# EAGLE board unified (EAGLE 7.7.0)
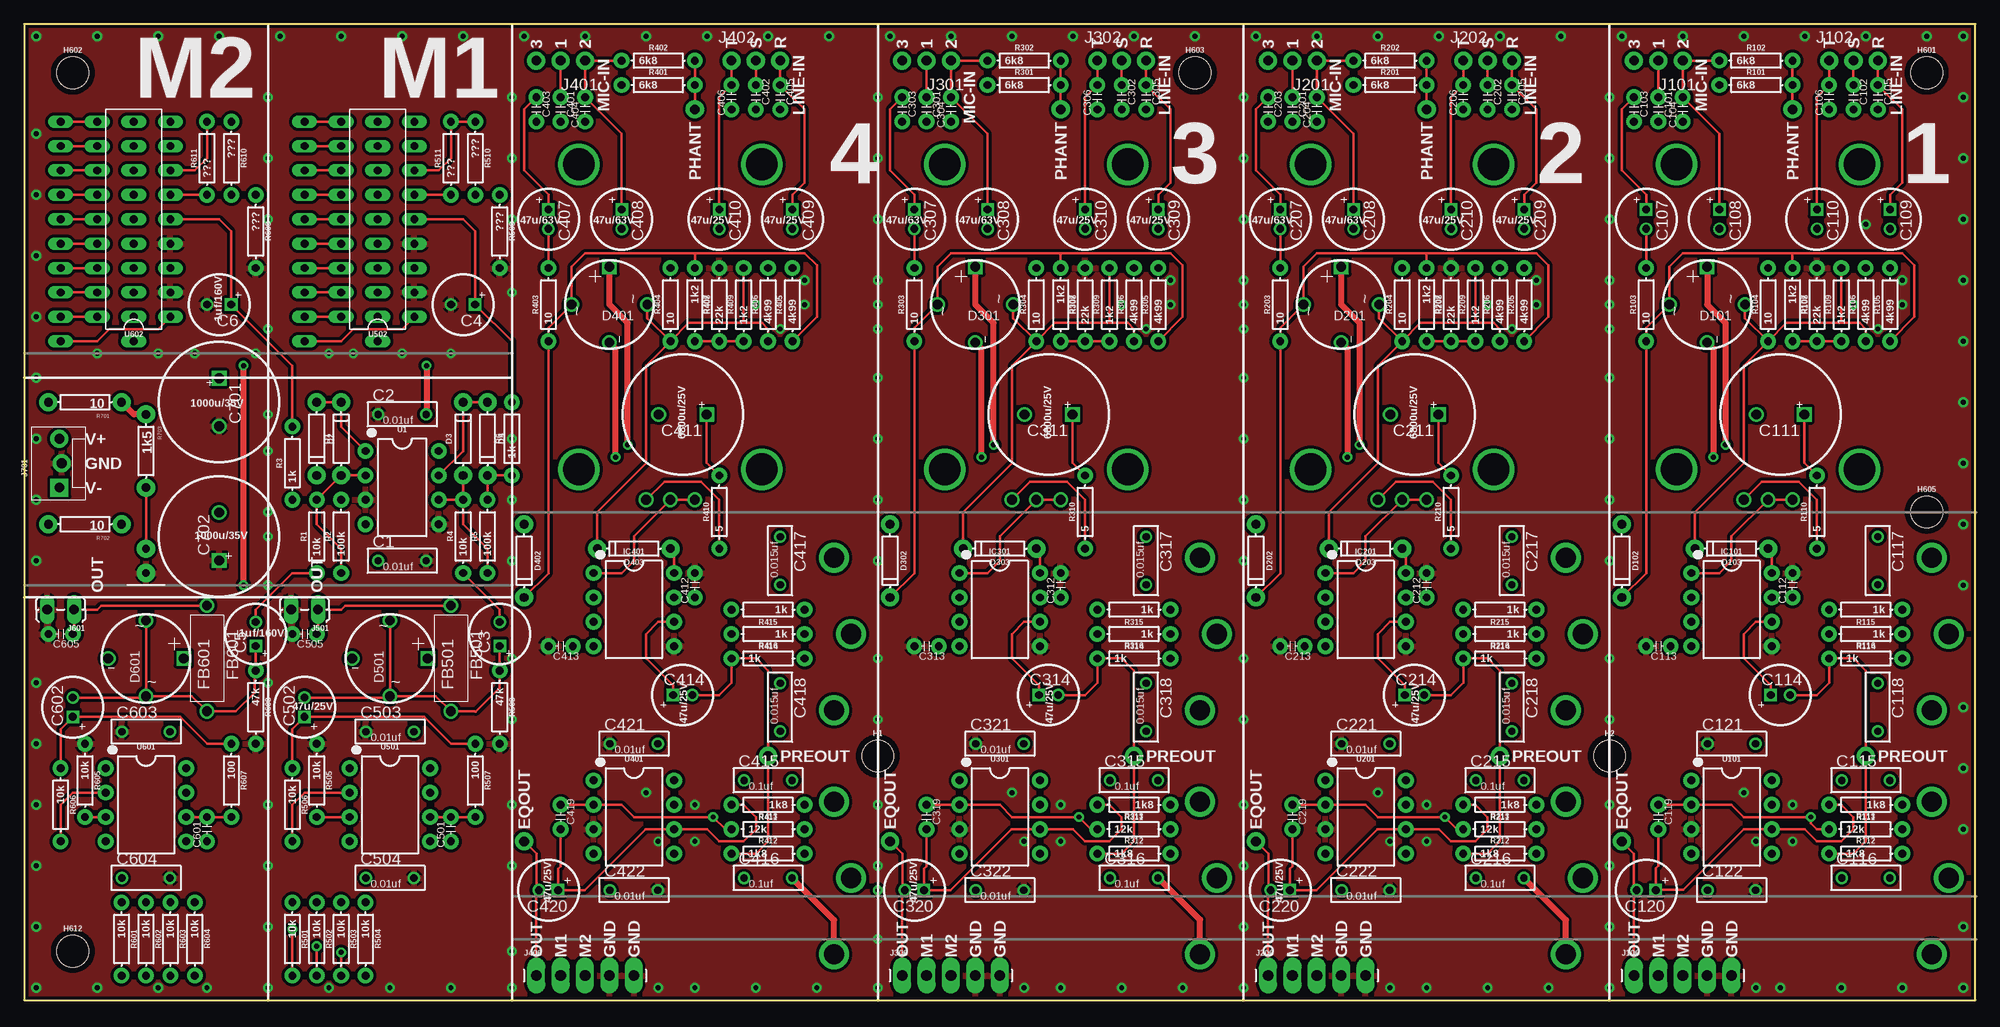
[diagram p7: board, top side]
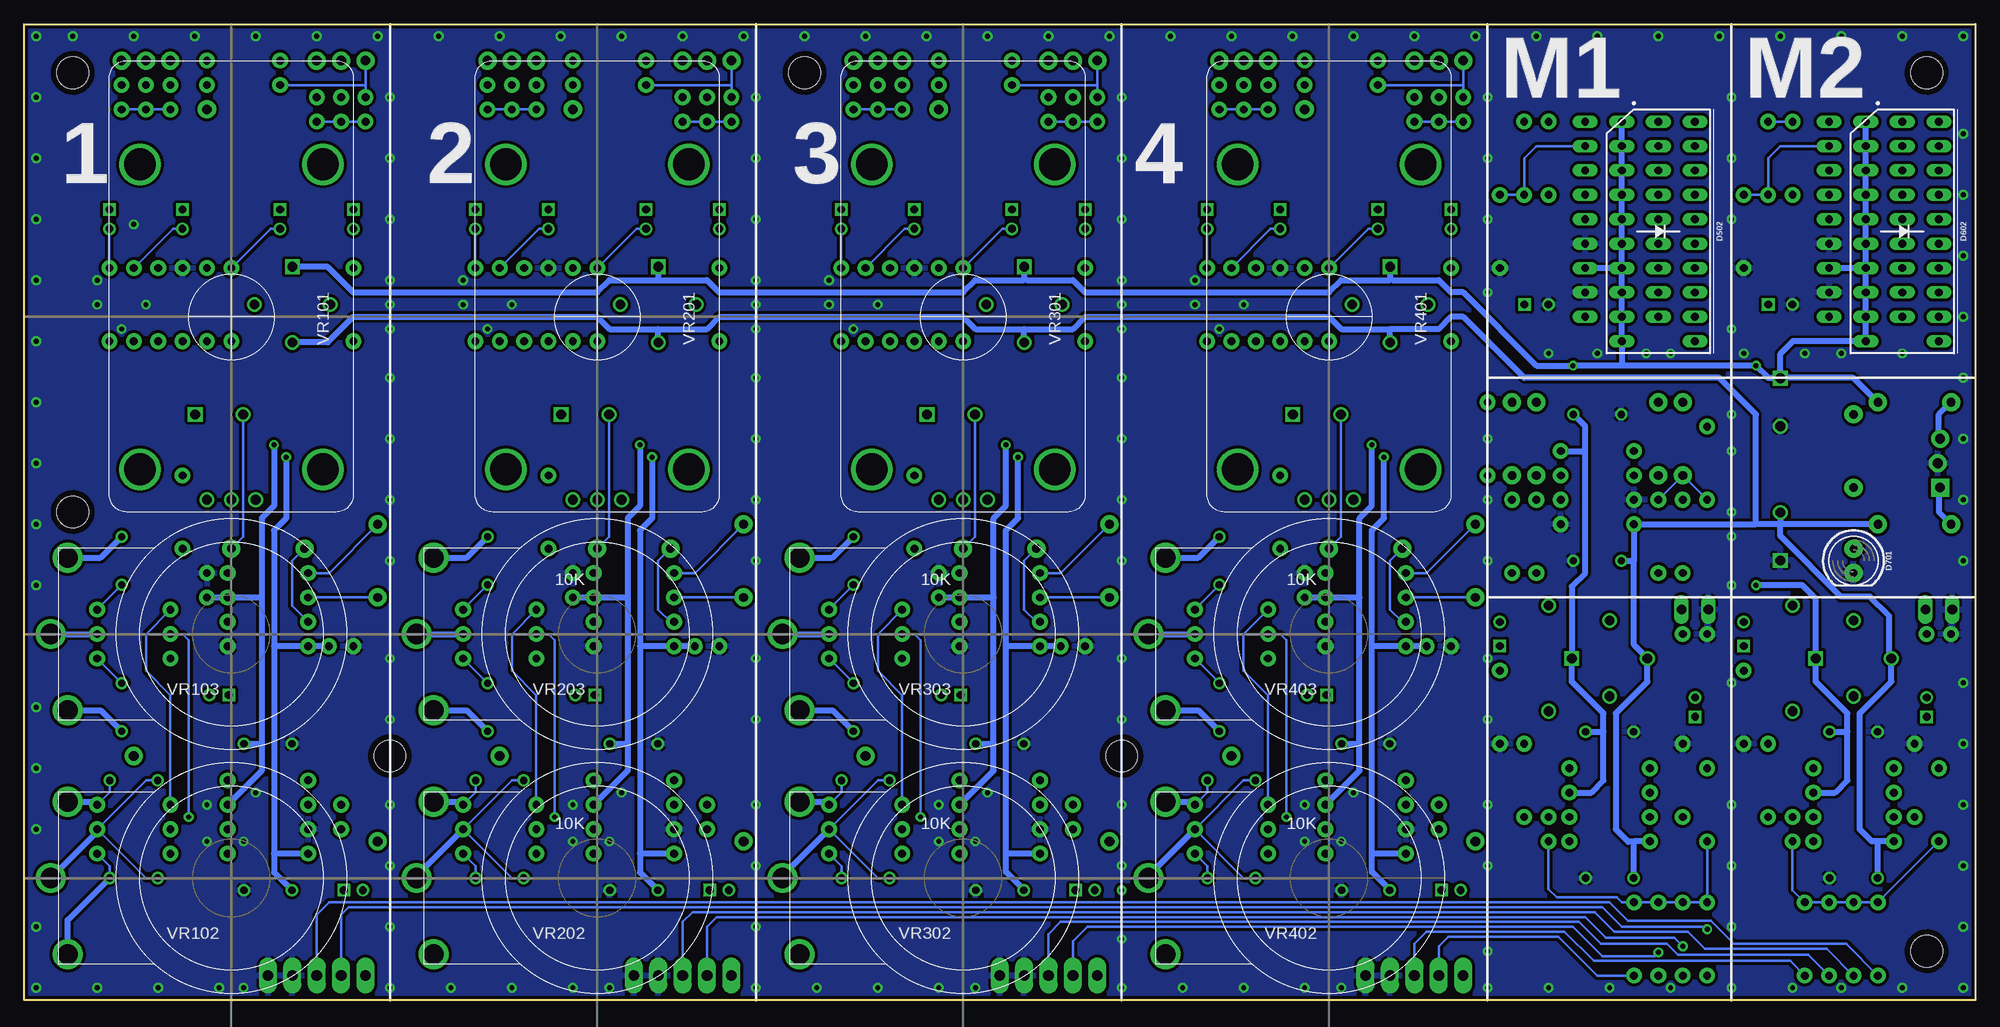
[diagram p8: board, bottom side, seen from below]

Size 203.2 x 101.6 mm. Coordinates in mm from the lower left corner, seen from the top.
Outline: 0,0 203.2,0 203.2,101.6 0,101.6 0,0
Copper layers (1*16): Top 0.035mm / dielectric 1.5mm / Bottom 0.035mm
Design rules "SparkFun-2-layer-STANDARD *": minimum track width 10mil, minimum drill 20mil, track to track 10mil, track to pad 10mil, pad to pad 10mil, via to via 10mil, smd to smd 8mil, copper to edge 8mil, drill to drill 8mil, minimum pad ring 10mil, minimum via ring 10mil, stop-mask expansion 4mil, vias tented up to drill 20mil, thermal gap 10mil
Net classes: 1 power: width 0.61 mm, drill 0.381 mm, clearance 0.254 mm; 2 signal: width 0.254 mm, drill 0.381 mm, clearance 0.254 mm

## Footprints (pad centres in the part's own frame; a part is rotated, then mirrored left to right if it is on the bottom)
WIMA-MKS2-2.5X7.2 = drill 0.75: P$1 2.5,0; P$2 -2.5,0
CAP-PANA-2.5LS-6DIAM = drill 0.8: NEG 1.25,0 | drill 0.8 square: POS -1.25,0
CAP-KEMET-GM-2.54LS = drill 0.813 pad 1.626: P$1 -1.27,0; P$2 1.27,0
CAP-PANA-2LS-6DIAM = drill 0.8: NEG 1,0 | drill 0.8 square: POS -1,0
CAP-PANA-2LS-5DIAM = drill 0.8: NEG 1,0 | drill 0.8 square: POS -1,0
CAP-PANA-5LS-12.5DIAM = drill 1.016: NEG 2.5,0 | drill 1.016 square: POS -2.5,0
DIODE-1N4148 = drill 0.9 pad 1.88: A -3.81,0; C 3.81,0
SM-RECTIFIER = drill 1.016: AC1 -3.937,0; AC2 3.937,0; NEG 0,3.937 | drill 1.016 square: POS 0,-3.937
LED_BARGRAPH_10 = drill 0.813 long: 1 -11.43,-3.81; 2 -8.89,-3.81; 3 -6.35,-3.81; 4 -3.81,-3.81; 5 -1.27,-3.81; 6 1.27,-3.81; 7 3.81,-3.81; 8 6.35,-3.81; 9 8.89,-3.81; 10 11.43,-3.81; 11 11.43,3.81; 12 8.89,3.81; 13 6.35,3.81; 14 3.81,3.81; 15 1.27,3.81; 16 -1.27,3.81; 17 -3.81,3.81; 18 -6.35,3.81; 19 -8.89,3.81; 20 -11.43,3.81
LED_5MM = drill 0.813 pad 1.88: A -1.27,0; K 1.27,0
BEAD = drill 1.016: P$1 5.5,0; P$2 -5.5,0
STAND-OFF = hole 3.302: 0,0
DIP08-KIT = drill 0.813 pad 1.626: 1 -3.81,-4.191; 2 -1.27,-4.191; 3 1.27,-4.191; 4 3.81,-4.191; 5 3.81,4.191; 6 1.27,4.191; 7 -1.27,4.191; 8 -3.81,4.191
1X03_NO_SILK@1 = drill 1.016 pad 1.88: 1 0,0; 2 2.54,0; 3 5.08,0
1X01NS-KIT = drill 1.016 pad 1.88: 1 0,0
1X05_LONGPADS = drill 1.118 pad 1.88 long: 1 0,0; 2 2.54,0; 3 5.08,0; 4 7.62,0; 5 10.16,0
1X02_LOCK_LONGPADS = drill 1.016 long: 1 -0.127,0; 2 2.667,0
MOLEX-1X3_LOCK = drill 1.016 pad 1.88 square: 1 0,0.127 | drill 1.016 pad 1.88: 2 2.54,-0.127; 3 5.08,0.127
AXIAL-0.3 = drill 0.813 pad 1.626: P$1 -3.81,0; P$2 3.81,0
AXIAL-0.3' = drill 0.9 pad 1.88: P$1 -3.81,0; P$2 3.81,0
DIP08 = drill 0.813 pad 1.626: 1 -3.81,-3.81; 2 -1.27,-3.81; 3 1.27,-3.81; 4 3.81,-3.81; 5 3.81,3.81; 6 1.27,3.81; 7 -1.27,3.81; 8 -3.81,3.81
DIL18 = drill 0.813 long: 1 -10.16,-3.81; 2 -7.62,-3.81; 3 -5.08,-3.81; 4 -2.54,-3.81; 5 0,-3.81; 6 2.54,-3.81; 7 5.08,-3.81; 8 7.62,-3.81; 9 10.16,-3.81; 10 10.16,3.81; 11 7.62,3.81; 12 5.08,3.81; 13 2.54,3.81; 14 0,3.81; 15 -2.54,3.81; 16 -5.08,3.81; 17 -7.62,3.81; 18 -10.16,3.81
ROT-SW-POT = drill 1.016: CCW 19.05,-2.54; CW 19.05,2.54; WIP 19.05,0 | drill 3.302: P$1 -15.875,-9.525; P$2 -15.875,9.525; P$3 15.875,9.525; P$4 15.875,-9.525
ALPHA-RV24AF40-POT = drill 2.1: CCW 17.039,-7.945; CW 17.039,7.945; WIP 18.8,0

## Placement (x,y rotation side)
C1  0.01uf  [WIMA-MKS2-2.5X7.2]  39.37,45.72 0 top
C2  0.01uf  [WIMA-MKS2-2.5X7.2]  39.37,60.96 0 top
C3  1uf/160V  [CAP-PANA-2.5LS-6DIAM]  49.53,38.1 90 top
C4  1uf/160V  [CAP-PANA-2.5LS-6DIAM]  45.72,72.39 180 top
C5  1uf/160V  [CAP-PANA-2.5LS-6DIAM]  24.13,38.1 90 top
C6  1uf/160V  [CAP-PANA-2.5LS-6DIAM]  20.32,72.39 180 top
C101  47pf  [CAP-KEMET-GM-2.54LS]  170.18,92.71 270 top
C102  47pf  [CAP-KEMET-GM-2.54LS]  190.5,93.98 270 top
C103  470pf  [CAP-KEMET-GM-2.54LS]  167.64,92.71 270 top
C104  470pf  [CAP-KEMET-GM-2.54LS]  172.72,92.71 90 top
C105  470pf  [CAP-KEMET-GM-2.54LS]  193.04,93.98 270 top
C106  470pf  [CAP-KEMET-GM-2.54LS]  187.96,93.98 90 top
C107  47u/63V  [CAP-PANA-2LS-6DIAM]  168.91,81.28 270 top
C108  47u/63V  [CAP-PANA-2LS-6DIAM]  176.53,81.28 270 top
C109  47u/25V  [CAP-PANA-2LS-5DIAM]  194.31,81.28 270 top
C110  47u/25V  [CAP-PANA-2LS-5DIAM]  186.69,81.28 270 top
C111  6800u/25V  [CAP-PANA-5LS-12.5DIAM]  182.88,60.96 180 top
C112  470pf  [CAP-KEMET-GM-2.54LS]  184.15,43.18 90 top
C113  470pf  [CAP-KEMET-GM-2.54LS]  170.18,36.83 180 top
C114  47u/25V  [CAP-PANA-2LS-5DIAM]  182.88,31.75 0 top
C115  0.1uf  [WIMA-MKS2-2.5X7.2]  191.77,22.86 0 top
C116  0.1uf  [WIMA-MKS2-2.5X7.2]  191.77,12.7 0 top
C117  0.015uf  [WIMA-MKS2-2.5X7.2]  193.04,45.72 270 top
C118  0.015uf  [WIMA-MKS2-2.5X7.2]  193.04,30.48 270 top
C119  100pf  [CAP-KEMET-GM-2.54LS]  170.18,19.05 270 top
C120  47u/25V  [CAP-PANA-2LS-5DIAM]  168.91,11.43 180 top
C121  0.01uf  [WIMA-MKS2-2.5X7.2]  177.8,26.67 0 top
C122  0.01uf  [WIMA-MKS2-2.5X7.2]  177.8,11.43 0 top
C201  47pf  [CAP-KEMET-GM-2.54LS]  132.08,92.71 270 top
C202  47pf  [CAP-KEMET-GM-2.54LS]  152.4,93.98 270 top
C203  470pf  [CAP-KEMET-GM-2.54LS]  129.54,92.71 270 top
C204  470pf  [CAP-KEMET-GM-2.54LS]  134.62,92.71 90 top
C205  470pf  [CAP-KEMET-GM-2.54LS]  154.94,93.98 270 top
C206  470pf  [CAP-KEMET-GM-2.54LS]  149.86,93.98 90 top
C207  47u/63V  [CAP-PANA-2LS-6DIAM]  130.81,81.28 270 top
C208  47u/63V  [CAP-PANA-2LS-6DIAM]  138.43,81.28 270 top
C209  47u/25V  [CAP-PANA-2LS-5DIAM]  156.21,81.28 270 top
C210  47u/25V  [CAP-PANA-2LS-5DIAM]  148.59,81.28 270 top
C211  6800u/25V  [CAP-PANA-5LS-12.5DIAM]  144.78,60.96 180 top
C212  470pf  [CAP-KEMET-GM-2.54LS]  146.05,43.18 90 top
C213  470pf  [CAP-KEMET-GM-2.54LS]  132.08,36.83 180 top
C214  47u/25V  [CAP-PANA-2LS-5DIAM]  144.78,31.75 0 top
C215  0.1uf  [WIMA-MKS2-2.5X7.2]  153.67,22.86 0 top
C216  0.1uf  [WIMA-MKS2-2.5X7.2]  153.67,12.7 0 top
C217  0.015uf  [WIMA-MKS2-2.5X7.2]  154.94,45.72 270 top
C218  0.015uf  [WIMA-MKS2-2.5X7.2]  154.94,30.48 270 top
C219  100pf  [CAP-KEMET-GM-2.54LS]  132.08,19.05 270 top
C220  47u/25V  [CAP-PANA-2LS-5DIAM]  130.81,11.43 180 top
C221  0.01uf  [WIMA-MKS2-2.5X7.2]  139.7,26.67 0 top
C222  0.01uf  [WIMA-MKS2-2.5X7.2]  139.7,11.43 0 top
C301  47pf  [CAP-KEMET-GM-2.54LS]  93.98,92.71 270 top
C302  47pf  [CAP-KEMET-GM-2.54LS]  114.3,93.98 270 top
C303  470pf  [CAP-KEMET-GM-2.54LS]  91.44,92.71 270 top
C304  470pf  [CAP-KEMET-GM-2.54LS]  96.52,92.71 90 top
C305  470pf  [CAP-KEMET-GM-2.54LS]  116.84,93.98 270 top
C306  470pf  [CAP-KEMET-GM-2.54LS]  111.76,93.98 90 top
C307  47u/63V  [CAP-PANA-2LS-6DIAM]  92.71,81.28 270 top
C308  47u/63V  [CAP-PANA-2LS-6DIAM]  100.33,81.28 270 top
C309  47u/25V  [CAP-PANA-2LS-5DIAM]  118.11,81.28 270 top
C310  47u/25V  [CAP-PANA-2LS-5DIAM]  110.49,81.28 270 top
C311  6800u/25V  [CAP-PANA-5LS-12.5DIAM]  106.68,60.96 180 top
C312  470pf  [CAP-KEMET-GM-2.54LS]  107.95,43.18 90 top
C313  470pf  [CAP-KEMET-GM-2.54LS]  93.98,36.83 180 top
C314  47u/25V  [CAP-PANA-2LS-5DIAM]  106.68,31.75 0 top
C315  0.1uf  [WIMA-MKS2-2.5X7.2]  115.57,22.86 0 top
C316  0.1uf  [WIMA-MKS2-2.5X7.2]  115.57,12.7 0 top
C317  0.015uf  [WIMA-MKS2-2.5X7.2]  116.84,45.72 270 top
C318  0.015uf  [WIMA-MKS2-2.5X7.2]  116.84,30.48 270 top
C319  100pf  [CAP-KEMET-GM-2.54LS]  93.98,19.05 270 top
C320  47u/25V  [CAP-PANA-2LS-5DIAM]  92.71,11.43 180 top
C321  0.01uf  [WIMA-MKS2-2.5X7.2]  101.6,26.67 0 top
C322  0.01uf  [WIMA-MKS2-2.5X7.2]  101.6,11.43 0 top
C401  47pf  [CAP-KEMET-GM-2.54LS]  55.88,92.71 270 top
C402  47pf  [CAP-KEMET-GM-2.54LS]  76.2,93.98 270 top
C403  470pf  [CAP-KEMET-GM-2.54LS]  53.34,92.71 270 top
C404  470pf  [CAP-KEMET-GM-2.54LS]  58.42,92.71 90 top
C405  470pf  [CAP-KEMET-GM-2.54LS]  78.74,93.98 270 top
C406  470pf  [CAP-KEMET-GM-2.54LS]  73.66,93.98 90 top
C407  47u/63V  [CAP-PANA-2LS-6DIAM]  54.61,81.28 270 top
C408  47u/63V  [CAP-PANA-2LS-6DIAM]  62.23,81.28 270 top
C409  47u/25V  [CAP-PANA-2LS-5DIAM]  80.01,81.28 270 top
C410  47u/25V  [CAP-PANA-2LS-5DIAM]  72.39,81.28 270 top
C411  6800u/25V  [CAP-PANA-5LS-12.5DIAM]  68.58,60.96 180 top
C412  470pf  [CAP-KEMET-GM-2.54LS]  69.85,43.18 90 top
C413  470pf  [CAP-KEMET-GM-2.54LS]  55.88,36.83 180 top
C414  47u/25V  [CAP-PANA-2LS-5DIAM]  68.58,31.75 0 top
C415  0.1uf  [WIMA-MKS2-2.5X7.2]  77.47,22.86 0 top
C416  0.1uf  [WIMA-MKS2-2.5X7.2]  77.47,12.7 0 top
C417  0.015uf  [WIMA-MKS2-2.5X7.2]  78.74,45.72 270 top
C418  0.015uf  [WIMA-MKS2-2.5X7.2]  78.74,30.48 270 top
C419  100pf  [CAP-KEMET-GM-2.54LS]  55.88,19.05 270 top
C420  47u/25V  [CAP-PANA-2LS-5DIAM]  54.61,11.43 180 top
C421  0.01uf  [WIMA-MKS2-2.5X7.2]  63.5,26.67 0 top
C422  0.01uf  [WIMA-MKS2-2.5X7.2]  63.5,11.43 0 top
C501  100pf  [CAP-KEMET-GM-2.54LS]  44.45,17.78 90 top
C502  47u/25V  [CAP-PANA-2LS-5DIAM]  29.21,30.48 90 top
C503  0.01uf  [WIMA-MKS2-2.5X7.2]  38.1,27.94 0 top
C504  0.01uf  [WIMA-MKS2-2.5X7.2]  38.1,12.7 0 top
C505  100pf  [CAP-KEMET-GM-2.54LS]  29.21,38.1 180 top
C601  100pf  [CAP-KEMET-GM-2.54LS]  19.05,17.78 90 top
C602  47u/25V  [CAP-PANA-2LS-5DIAM]  5.08,30.48 90 top
C603  0.01uf  [WIMA-MKS2-2.5X7.2]  12.7,27.94 0 top
C604  0.01uf  [WIMA-MKS2-2.5X7.2]  12.7,12.7 0 top
C605  100pf  [CAP-KEMET-GM-2.54LS]  3.81,38.1 180 top
C701  1000u/35V  [CAP-PANA-5LS-12.5DIAM]  20.32,62.23 270 top
C702  1000u/35V  [CAP-PANA-5LS-12.5DIAM]  20.32,48.26 90 top
D1  1n4148  [DIODE-1N4148]  33.02,58.42 90 top
D2  1n4148  [DIODE-1N4148]  30.48,58.42 270 top
D3  1n4148  [DIODE-1N4148]  45.72,58.42 90 top
D4  1n4148  [DIODE-1N4148]  48.26,58.42 270 top
D101  RECTIFIERRB15X  [SM-RECTIFIER]  175.26,72.39 180 top
D102  200mA/100V/1V  [DIODE-1N4148]  166.37,45.72 270 top
D103  200mA/100V/1V  [DIODE-1N4148]  177.8,46.99 180 top
D201  RECTIFIERRB15X  [SM-RECTIFIER]  137.16,72.39 180 top
D202  200mA/100V/1V  [DIODE-1N4148]  128.27,45.72 270 top
D203  200mA/100V/1V  [DIODE-1N4148]  139.7,46.99 180 top
D301  RECTIFIERRB15X  [SM-RECTIFIER]  99.06,72.39 180 top
D302  200mA/100V/1V  [DIODE-1N4148]  90.17,45.72 270 top
D303  200mA/100V/1V  [DIODE-1N4148]  101.6,46.99 180 top
D401  RECTIFIERRB15X  [SM-RECTIFIER]  60.96,72.39 180 top
D402  200mA/100V/1V  [DIODE-1N4148]  52.07,45.72 270 top
D403  200mA/100V/1V  [DIODE-1N4148]  63.5,46.99 180 top
D501  RECTIFIERRB15X  [SM-RECTIFIER]  38.1,35.56 90 top
D502  RED  [LED_BARGRAPH_10]  33.02,80.01 270 bottom
D601  RECTIFIERRB15X  [SM-RECTIFIER]  12.7,35.56 90 top
D602  RED  [LED_BARGRAPH_10]  7.62,80.01 270 bottom
D701  [LED_5MM]  12.7,45.72 270 bottom
FB501  FB  [BEAD]  44.45,35.56 270 top
FB601  FB  [BEAD]  19.05,35.56 270 top
FRAME101  FRAME-LEDGER  [CREATIVE_COMMONS]  81.28,-71.12 0 top  (outside the outline)
FRAME201  FRAME-LEDGER  [CREATIVE_COMMONS]  81.28,-71.12 0 top  (outside the outline)
FRAME301  FRAME-LEDGER  [CREATIVE_COMMONS]  81.28,-71.12 0 top  (outside the outline)
FRAME401  FRAME-LEDGER  [CREATIVE_COMMONS]  81.28,-71.12 0 top  (outside the outline)
FRAME501  FRAME-LEDGER  [CREATIVE_COMMONS]  81.28,-71.12 0 top  (outside the outline)
FRAME601  FRAME-LEDGER  [CREATIVE_COMMONS]  81.28,-71.12 0 top  (outside the outline)
FRAME701  FRAME-LEDGER  [CREATIVE_COMMONS]  81.28,-71.12 0 top  (outside the outline)
H1  STAND-OFF  [STAND-OFF]  88.9,25.4 0 top
H2  STAND-OFF  [STAND-OFF]  165.1,25.4 0 top
H601  STAND-OFF  [STAND-OFF]  198.12,96.52 0 top
H602  STAND-OFF  [STAND-OFF]  5.08,96.52 0 top
H603  STAND-OFF  [STAND-OFF]  121.92,96.52 0 top
H605  STAND-OFF  [STAND-OFF]  198.12,50.8 0 top
H612  STAND-OFF  [STAND-OFF]  5.08,5.08 0 top
IC101  THAT1512  [DIP08-KIT]  177.8,40.64 270 top
IC201  THAT1512  [DIP08-KIT]  139.7,40.64 270 top
IC301  THAT1512  [DIP08-KIT]  101.6,40.64 270 top
IC401  THAT1512  [DIP08-KIT]  63.5,40.64 270 top
J101  [1X03_NO_SILK@1]  172.72,97.79 180 top
J102  [1X03_NO_SILK@1]  187.96,97.79 0 top
J103  phantom  [1X01NS-KIT]  184.15,92.71 90 top
J104  eqout  [1X01NS-KIT]  191.77,25.4 90 top
J105  eqout  [1X01NS-KIT]  166.37,16.51 0 top
J106  [1X05_LONGPADS]  167.64,2.54 0 top
J201  [1X03_NO_SILK@1]  134.62,97.79 180 top
J202  [1X03_NO_SILK@1]  149.86,97.79 0 top
J203  phantom  [1X01NS-KIT]  146.05,92.71 0 top
J204  eqout  [1X01NS-KIT]  153.67,25.4 0 top
J205  eqout  [1X01NS-KIT]  128.27,16.51 0 top
J206  [1X05_LONGPADS]  129.54,2.54 0 top
J301  [1X03_NO_SILK@1]  96.52,97.79 180 top
J302  [1X03_NO_SILK@1]  111.76,97.79 0 top
J303  phantom  [1X01NS-KIT]  107.95,92.71 0 top
J304  eqout  [1X01NS-KIT]  115.57,25.4 0 top
J305  eqout  [1X01NS-KIT]  90.17,16.51 0 top
J306  [1X05_LONGPADS]  91.44,2.54 0 top
J401  [1X03_NO_SILK@1]  58.42,97.79 180 top
J402  [1X03_NO_SILK@1]  73.66,97.79 0 top
J403  phantom  [1X01NS-KIT]  69.85,92.71 0 top
J404  eqout  [1X01NS-KIT]  77.47,25.4 0 top
J405  eqout  [1X01NS-KIT]  52.07,16.51 0 top
J406  [1X05_LONGPADS]  53.34,2.54 0 top
J501  out2  [1X02_LOCK_LONGPADS]  30.48,40.64 180 top
J601  out2  [1X02_LOCK_LONGPADS]  5.08,40.64 180 top
J701  power  [MOLEX-1X3_LOCK]  3.81,53.34 90 top
R1  10k  [AXIAL-0.3]  30.48,48.26 90 top
R2  100k  [AXIAL-0.3]  33.02,48.26 90 top
R3  1k  [AXIAL-0.3]  27.94,55.88 90 top
R4  10k  [AXIAL-0.3]  45.72,48.26 90 top
R5  100k  [AXIAL-0.3]  48.26,48.26 90 top
R6  1k  [AXIAL-0.3]  50.8,58.42 90 top
R101  6k8  [AXIAL-0.3]  180.34,95.25 0 top
R102  6k8  [AXIAL-0.3]  180.34,97.79 0 top
R103  10  [AXIAL-0.3]  168.91,72.39 90 top
R104  10  [AXIAL-0.3]  181.61,72.39 90 top
R105  4k99  [AXIAL-0.3]  194.31,72.39 90 top
R106  4k99  [AXIAL-0.3]  191.77,72.39 90 top
R107  22k  [AXIAL-0.3]  186.69,72.39 90 top
R108  1k2  [AXIAL-0.3]  184.15,72.39 270 top
R109  1k2  [AXIAL-0.3]  189.23,72.39 90 top
R110  5  [AXIAL-0.3]  186.69,50.8 90 top
R111  1k8  [AXIAL-0.3]  191.77,20.32 180 top
R112  1k8  [AXIAL-0.3]  191.77,15.24 0 top
R113  12k  [AXIAL-0.3]  191.77,17.78 0 top
R114  1k  [AXIAL-0.3]  191.77,38.1 180 top
R115  1k  [AXIAL-0.3]  191.77,40.64 180 top
R116  1k  [AXIAL-0.3]  191.77,35.56 0 top
R201  6k8  [AXIAL-0.3]  142.24,95.25 0 top
R202  6k8  [AXIAL-0.3]  142.24,97.79 0 top
R203  10  [AXIAL-0.3]  130.81,72.39 90 top
R204  10  [AXIAL-0.3]  143.51,72.39 90 top
R205  4k99  [AXIAL-0.3]  156.21,72.39 90 top
R206  4k99  [AXIAL-0.3]  153.67,72.39 90 top
R207  22k  [AXIAL-0.3]  148.59,72.39 90 top
R208  1k2  [AXIAL-0.3]  146.05,72.39 270 top
R209  1k2  [AXIAL-0.3]  151.13,72.39 90 top
R210  5  [AXIAL-0.3]  148.59,50.8 90 top
R211  1k8  [AXIAL-0.3]  153.67,20.32 180 top
R212  1k8  [AXIAL-0.3]  153.67,15.24 0 top
R213  12k  [AXIAL-0.3]  153.67,17.78 0 top
R214  1k  [AXIAL-0.3]  153.67,38.1 180 top
R215  1k  [AXIAL-0.3]  153.67,40.64 180 top
R216  1k  [AXIAL-0.3]  153.67,35.56 0 top
R301  6k8  [AXIAL-0.3]  104.14,95.25 0 top
R302  6k8  [AXIAL-0.3]  104.14,97.79 0 top
R303  10  [AXIAL-0.3]  92.71,72.39 90 top
R304  10  [AXIAL-0.3]  105.41,72.39 90 top
R305  4k99  [AXIAL-0.3]  118.11,72.39 90 top
R306  4k99  [AXIAL-0.3]  115.57,72.39 90 top
R307  22k  [AXIAL-0.3]  110.49,72.39 90 top
R308  1k2  [AXIAL-0.3]  107.95,72.39 270 top
R309  1k2  [AXIAL-0.3]  113.03,72.39 90 top
R310  5  [AXIAL-0.3]  110.49,50.8 90 top
R311  1k8  [AXIAL-0.3]  115.57,20.32 180 top
R312  1k8  [AXIAL-0.3]  115.57,15.24 0 top
R313  12k  [AXIAL-0.3]  115.57,17.78 0 top
R314  1k  [AXIAL-0.3]  115.57,38.1 180 top
R315  1k  [AXIAL-0.3]  115.57,40.64 180 top
R316  1k  [AXIAL-0.3]  115.57,35.56 0 top
R401  6k8  [AXIAL-0.3]  66.04,95.25 0 top
R402  6k8  [AXIAL-0.3]  66.04,97.79 0 top
R403  10  [AXIAL-0.3]  54.61,72.39 90 top
R404  10  [AXIAL-0.3]  67.31,72.39 90 top
R405  4k99  [AXIAL-0.3]  80.01,72.39 90 top
R406  4k99  [AXIAL-0.3]  77.47,72.39 90 top
R407  22k  [AXIAL-0.3]  72.39,72.39 90 top
R408  1k2  [AXIAL-0.3]  69.85,72.39 270 top
R409  1k2  [AXIAL-0.3]  74.93,72.39 90 top
R410  5  [AXIAL-0.3]  72.39,50.8 90 top
R411  1k8  [AXIAL-0.3]  77.47,20.32 180 top
R412  1k8  [AXIAL-0.3]  77.47,15.24 0 top
R413  12k  [AXIAL-0.3]  77.47,17.78 0 top
R414  1k  [AXIAL-0.3]  77.47,38.1 180 top
R415  1k  [AXIAL-0.3]  77.47,40.64 180 top
R416  1k  [AXIAL-0.3]  77.47,35.56 0 top
R501  10k  [AXIAL-0.3]  27.94,6.35 270 top
R502  10k  [AXIAL-0.3]  30.48,6.35 270 top
R503  10k  [AXIAL-0.3]  33.02,6.35 270 top
R504  10k  [AXIAL-0.3]  35.56,6.35 270 top
R505  10k  [AXIAL-0.3]  30.48,22.86 270 top
R506  10k  [AXIAL-0.3]  27.94,20.32 270 top
R507  100  [AXIAL-0.3]  46.99,22.86 270 top
R508  47k  [AXIAL-0.3]  49.53,30.48 270 top
R509  ???  [AXIAL-0.3]  49.53,80.01 270 top
R510  ???  [AXIAL-0.3]  46.99,87.63 270 top
R511  ???  [AXIAL-0.3]  44.45,87.63 90 top
R601  10k  [AXIAL-0.3]  10.16,6.35 270 top
R602  10k  [AXIAL-0.3]  12.7,6.35 270 top
R603  10k  [AXIAL-0.3]  15.24,6.35 270 top
R604  10k  [AXIAL-0.3]  17.78,6.35 270 top
R605  10k  [AXIAL-0.3]  6.35,22.86 270 top
R606  10k  [AXIAL-0.3]  3.81,20.32 270 top
R607  100  [AXIAL-0.3]  21.59,22.86 270 top
R608  47k  [AXIAL-0.3]  24.13,30.48 270 top
R609  ???  [AXIAL-0.3]  24.13,80.01 270 top
R610  ???  [AXIAL-0.3]  21.59,87.63 270 top
R611  ???  [AXIAL-0.3]  19.05,87.63 90 top
R701  10  [AXIAL-0.3']  6.35,62.23 180 top
R702  10  [AXIAL-0.3']  6.35,49.53 180 top
R703  1k5  [AXIAL-0.3']  12.7,57.15 270 top
U1  LM358  [DIP08]  39.37,53.34 270 top
U101  lme49710  [DIP08-KIT]  177.8,19.05 270 top
U201  lme49710  [DIP08-KIT]  139.7,19.05 270 top
U301  lme49710  [DIP08-KIT]  101.6,19.05 270 top
U401  lme49710  [DIP08-KIT]  63.5,19.05 270 top
U501  lme49710  [DIP08-KIT]  38.1,20.32 270 top
U502  LM3915N  [DIL18]  36.83,81.28 90 top
U601  lme49710  [DIP08-KIT]  12.7,20.32 270 top
U602  LM3915N  [DIL18]  11.43,81.28 90 top
VR101  10K  [ROT-SW-POT]  181.61,71.12 270 bottom
VR102  10K  [ALPHA-RV24AF40-POT]  181.61,12.7 180 bottom
VR103  10K  [ALPHA-RV24AF40-POT]  181.61,38.1 180 bottom
VR201  10K  [ROT-SW-POT]  143.51,71.12 270 bottom
VR202  10K  [ALPHA-RV24AF40-POT]  143.51,12.7 180 bottom
VR203  10K  [ALPHA-RV24AF40-POT]  143.51,38.1 180 bottom
VR301  10K  [ROT-SW-POT]  105.41,71.12 270 bottom
VR302  10K  [ALPHA-RV24AF40-POT]  105.41,12.7 180 bottom
VR303  10K  [ALPHA-RV24AF40-POT]  105.41,38.1 180 bottom
VR401  10K  [ROT-SW-POT]  67.31,71.12 270 bottom
VR402  10K  [ALPHA-RV24AF40-POT]  67.31,12.7 180 bottom
VR403  10K  [ALPHA-RV24AF40-POT]  67.31,38.1 180 bottom

## Tracks (layer width: path | path; a pad name or v marks a point on that pad's centre or on a via)
1TO1  (via drill 0.51)
  Top 0.254: v27.94,7.37 R501.P$2
  Bottom 0.254: J106.2 170.18,8.89 169.42,9.65 38.86,9.65 36.83,7.62 28.19,7.62 v27.94,7.37
1TO2
  Bottom 0.254: J106.3 172.72,8.89 171.45,10.16 38.1,10.16 36.2,8.26 27.56,8.26 25.15,5.84 13.46,5.84 R601.P$2
2TO1  (via drill 0.51)
  Top 0.254: v30.48,5.59 R502.P$2
  Bottom 0.254: J206.2 132.08,7.62 131.06,8.64 40.64,8.64 38.48,6.48 31.37,6.48 v30.48,5.59
2TO2
  Bottom 0.254: J206.3 134.62,8.13 133.6,9.14 39.62,9.14 37.59,7.11 29.97,7.11 28.19,5.33 15.49,5.33 R602.P$2
3TO1  (via drill 0.51)
  Top 0.254: v33.02,4.95 R503.P$2
  Bottom 0.254: J306.2 93.98,6.1 92.46,7.62 41.91,7.62 38.86,4.57 33.4,4.57 v33.02,4.95
3TO2
  Bottom 0.254: J306.3 96.52,6.86 95.25,8.13 41.27,8.13 38.99,5.84 32.13,5.84 30.99,4.7 17.4,4.7 R603.P$2
4TO1
  Bottom 0.254: J406.2 55.88,5.59 54.86,6.6 43.43,6.6 39.37,2.54 R504.P$2
4TO2
  Bottom 0.254: J406.3 58.42,5.84 57.15,7.11 42.8,7.11 39.75,4.06 19.3,4.06 R604.P$2
EQ1OUT
  Top 0.254: J105.1 167.64,15.24 167.64,11.47 arc-90 167.68,11.43 | J106.1 167.64,11.39 arc-90 167.68,11.43 | C120.NEG 167.68,11.43
EQ2OUT
  Top 0.254: J206.1 129.54,11.16 C220.NEG 129.58,11.66 129.58,15.2 J205.1
EQ3OUT
  Top 0.254: J306.1 91.44,11.16 C320.NEG 91.48,11.66 91.48,15.2 J305.1
EQ4OUT
  Top 0.254: J406.1 53.34,11.16 C420.NEG 53.38,11.66 53.38,15.2 J405.1
GND  (via drill 0.51)
  other vias: 191.77,80.74 1.27,1.27 1.27,7.62 1.27,13.97 1.27,20.32 1.27,26.67 1.27,33.02 1.27,45.72 1.27,52.07 1.27,58.42 1.27,64.77 1.27,71.12 1.27,77.47 1.27,83.82 1.27,90.17 13.97,100.33 7.62,100.33 1.27,100.33 33.02,100.33 26.67,100.33 20.32,100.33 52.07,100.33 45.72,100.33 39.37,100.33 71.12,100.33 64.77,100.33 58.42,100.33 179.07,100.33 198.12,100.33 191.77,100.33 185.42,100.33 201.93,100.33 201.93,93.98 153.67,100.33 172.72,100.33 166.37,100.33 160.02,100.33 128.27,100.33 147.32,100.33 140.97,100.33 134.62,100.33 102.87,100.33 121.92,100.33 115.57,100.33 109.22,100.33 77.47,100.33 96.52,100.33 90.17,100.33 83.82,100.33 201.93,24.13 201.93,17.78 201.93,30.48 201.93,49.53 201.93,43.18 201.93,62.23 201.93,55.88 201.93,74.93 201.93,68.58 201.93,87.63 201.93,81.28 201.93,7.62 201.93,1.27 195.58,1.27 189.23,1.27 182.88,1.27 180.34,1.27 165.1,1.27 158.75,1.27 152.4,1.27 146.05,1.27 142.24,1.27 127,1.27 120.65,1.27 114.3,1.27 107.95,1.27 104.14,1.27 88.9,1.27 82.55,1.27 50.8,1.27 69.85,1.27 76.2,1.27 66.04,1.27 44.45,1.27 38.1,1.27 31.75,1.27 25.4,1.27 19.05,1.27 7.62,1.27 13.97,1.27 184.15,16.51 184.15,20.32 179.07,21.59 146.05,20.32 146.05,16.51 140.97,21.59 180.34,16.51 142.24,16.51 104.14,16.51 107.95,16.51 107.95,20.32 102.87,21.59 66.04,16.51 69.85,16.51 69.85,20.32 64.77,21.59 165.1,7.62 165.1,13.97 165.1,20.32 165.1,29.21 165.1,35.56 165.1,45.72 165.1,52.07 165.1,58.42 165.1,64.77 165.1,69.85 165.1,72.39 165.1,74.93 165.1,81.28 165.1,87.63 165.1,93.98 88.9,6.35 88.9,13.97 88.9,20.32 88.9,29.21 88.9,35.56 88.9,45.72 127,7.62 127,13.97 127,20.32 127,29.21 127,35.56 127,45.72 50.8,5.08 50.8,13.97 50.8,20.32 50.8,29.21 50.8,35.56 50.8,45.72 50.8,52.07 50.8,58.42 50.8,73.66 50.8,81.28 50.8,87.63 50.8,93.98 88.9,52.07 88.9,58.42 88.9,64.77 88.9,69.85 88.9,72.39 88.9,74.93 88.9,81.28 88.9,87.63 88.9,93.98 127,52.07 127,58.42 127,64.77 127,69.85 127,72.39 127,74.93 127,81.28 127,87.63 127,93.98 25.4,7.62 25.4,13.97 25.4,20.32 25.4,33.02 25.4,43.18 25.4,93.98 25.4,87.63 25.4,81.28 25.4,69.85 24.13,67.31 25.4,48.26 25.4,50.8 25.4,57.15 25.4,60.96 7.62,67.31 13.97,67.31 17.78,67.31 31.75,67.31 34.29,67.31 39.37,67.31 44.45,67.31 157.48,72.39 152.4,72.39 154.94,69.85 157.48,74.93 81.28,72.39 76.2,72.39 78.74,69.85 81.28,74.93 119.38,72.39 114.3,72.39 116.84,69.85 119.38,74.93 195.58,72.39 190.5,72.39 193.04,69.85 195.58,74.93
  pour Bottom (isolate 0.305): 0,0 0,101.6 203.2,101.6 203.2,0
  pour Top (isolate 0.305): 203.2,0 203.2,101.6 0,101.6 0,0
GND1  (via drill 0.51)
  other vias: 88.9,11.43
HIGHEST
  Top 0.254: D602.20 U602.10
HIGHEST1
  Top 0.254: D502.20 U502.10
L1+
  Top 0.254: C110.POS 186.69,93.98 C106.P$2 J102.1
L1-
  Top 0.254: C109.POS 194.31,83.82 195.58,85.09 195.58,92.71 C105.P$1 J102.3
L1GND
  Top 0.254: J102.2 C102.P$1
LOWEST
  Top 0.254: D602.11 7.62,68.58 8.89,69.85 13.97,69.85 U602.1
LOWEST1
  Top 0.254: D502.11 33.02,68.58 34.29,69.85 39.37,69.85 U502.1
M1+
  Top 0.254: C108.POS 176.53,90.17 C104.P$2 J101.1 R102.P$1
M1-
  Top 0.254: C107.POS 168.91,83.82 166.37,86.36 166.37,92.71 C103.P$1
  Bottom 0.254: 167.64,95.25 C103.P$1 | J101.3 167.64,95.25 | R101.P$1 167.64,95.25
M1GND
  Top 0.254: J101.2 C101.P$1
N$1
  Bottom 0.254: 195.91,20.64 R111.P$1 194.27,21.63 C115.P$1
  Bottom 0.61: VR102.CCW 195.91,20.64
N$2
  Bottom 0.254: C116.P$1 194.27,13.93 R112.P$2
  Bottom 0.61: VR102.CW 198.65,8.32 C116.P$1
N$3  (via drill 0.51)
  Top 0.254: C119.P$1 U101.2 177.8,20.32 179.07,19.05 v186.06,19.05 186.06,18.41 186.69,17.78 R113.P$1
  Bottom 0.254: v186.06,19.05 186.06,37.47 186.69,38.1 R114.P$2
N$4
  Bottom 0.254: R116.P$2 195.58,35.52 C118.P$2
N$5
  Top 0.254: R2.P$1 33.02,46.99 30.48,49.53 R1.P$2 D1.A U1.2
N$6
  Top 0.254: C119.P$2 170.18,13.97 169.91,13.7 C120.POS 169.95,11.47 172.76,11.47 179.07,17.78 U101.6 185.42,17.78 186.69,16.51 189.23,16.51 190.5,17.78 190.5,19.05 189.23,20.32 R111.P$2
  Bottom 0.254: R111.P$2 187.96,31.75 190.5,34.29 190.5,38.1 R115.P$2
N$7
  Top 0.254: FB601.P$2 8.04,41.06 7.62,40.64 J601.1 5.21,38.23 C605.P$1
N$8
  Bottom 0.61: VR103.WIP R114.P$1
N$9
  Top 0.254: U1.1 33.02,59.69 D1.C D2.A
N$10
  Bottom 0.61: VR103.CW 195.22,30.16 C118.P$1
N$11
  Top 0.254: D601.AC1 D601.AC2 | R608.P$1 C5.POS | C602.NEG 12.56,31.48 D601.AC1 | D601.AC1 17.49,31.62 FB601.P$1 22.06,30.06 24,32 24,34.16 R608.P$1 | R608.P$1 24.13,34.87 24,35
N$12
  Top 0.254: R606.P$1 3.81,28.21 C602.POS 16.24,29.48 19.05,26.67 R607.P$1
N$13
  Top 0.254: R605.P$2 U601.3
N$14
  Bottom 0.254: C116.P$2 190.5,12.7 R113.P$2 | C115.P$2 190.5,22.86 R113.P$2 | R113.P$2 195.58,17.53
  Bottom 0.61: 195.58,17.53 VR102.WIP
N$15
  Bottom 0.61: VR103.CCW 195.22,46.05 C117.P$2
N$16
  Top 0.254: U601.6 C601.P$2 R607.P$2
N$17
  Top 0.254: R606.P$2 3.81,20.32 5.08,21.59 U601.2
  Bottom 0.254: R606.P$2 R601.P$1 R602.P$1 R603.P$1 R604.P$1 19.05,11.43 C601.P$1
N$18
  Bottom 0.254: R3.P$1 D2.C R2.P$2
N$19
  Bottom 0.254: R115.P$1 195.58,40.68 C117.P$1
N$20
  Top 0.254: R212.P$1 152.4,15.24 153.67,16.51 J204.1 153.67,34.29 152.4,35.56 R216.P$1 149.86,33.02 148.59,31.75 C214.NEG
N$21
  Top 0.254: IC101.8 181.99,46.61 D103.A
  Bottom 0.254: C111.NEG 180.38,48.22 D103.A
N$22
  Top 0.254: C114.POS 181.88,32.75 179.07,35.56 179.07,38.1 180.34,39.37 IC101.6
N$23
  Top 0.254: R3.P$2 27.94,66.02 C6.POS 21.57,80.03 20.32,81.28 U602.5
N$24
  Bottom 0.254: C103.P$2 C101.P$2 C104.P$1
N$25
  Top 0.254: R5.P$1 48.26,46.99 45.72,49.53 R4.P$2 | R4.P$2 U1.6 | R4.P$2 D3.A
N$26
  Top 0.254: U1.7 45.72,57.15 D3.C D4.A
N$27
  Bottom 0.254: R104.P$2 177.53,80.28 C108.NEG
N$28
  Top 0.254: R102.P$2 R101.P$2 J103.1
N$29
  Top 0.254: C107.NEG R103.P$2
N$30
  Top 0.254: 184.15,77.74 172.72,77.74 171.32,76.34 D101.AC2 168.91,69.98 R103.P$1 168.91,44.45 D102.C | 184.15,77.74 R108.P$1 | R105.P$1 196.85,71.12 196.85,76.47 195.58,77.74 184.15,77.74
  Bottom 0.254: IC101.2 D102.C
N$31
  Top 0.254: R109.P$2 189.23,70.48 | 189.23,70.48 191.13,70.48 191.77,69.85 R106.P$1 | D103.C 173.99,50.8 179.07,55.88 179.07,66.04 R104.P$1 | R104.P$1 183.51,70.48 189.23,70.48 | D101.AC1 179.2,70.99 R104.P$1
  Bottom 0.254: D103.C 175.26,45.72 175.26,41.02 IC101.3
N$32
  Top 0.254: R109.P$1 R107.P$1 R108.P$2
N$33
  Top 0.254: VR101.CCW VR101.WIP 177.8,48.26 177.8,45.72 176.53,44.45 IC101.1
  Bottom 0.254: IC101.1 171.45,44.45 D102.A
N$34
  Top 0.254: R110.P$1 186.69,52.07 184.78,53.98 180.97,53.98 VR101.CW
N$35
  Top 0.254: C111.POS 185.38,55.92 R110.P$2
N$36
  Top 0.254: R5.P$2 D4.C R6.P$1
N$37
  Bottom 0.254: C106.P$1 C102.P$2 C105.P$2
N$38
  Top 0.254: C3.NEG 49.53,40.64 R4.P$1
N$39
  Top 0.254: R6.P$2 50.8,68.56 C4.POS 46.97,80.03 45.72,81.28 U502.5
N$40
  Bottom 0.254: R106.P$2 187.69,80.28 C110.NEG
N$41
  Top 0.254: D602.12 U602.18
N$42
  Bottom 0.254: C109.NEG R105.P$2
N$43
  Top 0.254: D602.13 U602.17
N$44
  Top 0.254: D602.14 U602.16
N$45
  Top 0.254: D602.15 U602.15
N$46
  Top 0.254: D602.16 U602.14
N$47
  Top 0.254: D602.17 U602.13
N$48
  Top 0.254: D602.18 U602.12
N$49
  Top 0.254: D602.19 U602.11
N$50
  Bottom 0.254: C215.P$1 156.17,21.63 R211.P$1
  Bottom 0.61: VR202.CCW 157.81,20.64 R211.P$1
N$51
  Top 0.254: U602.7 17.78,86.36 19.05,87.63 R611.P$2
  Bottom 0.254: R611.P$2 R610.P$1
N$52
  Bottom 0.254: U602.8 20.32,88.9 21.59,87.63 R610.P$2 R609.P$1
N$53
  Top 0.254: U602.6 R611.P$1
N$54
  Top 0.254: C5.NEG 24.13,40.64 27.94,44.45 R1.P$1
N$55
  Top 0.61: VR202.CW 160.55,8.32 C216.P$1
  Bottom 0.254: C216.P$1 156.17,13.93 R212.P$2
N$56
  Bottom 0.61: VR203.WIP R214.P$1
N$57
  Bottom 0.254: C215.P$2 152.4,22.86 R213.P$2 152.4,12.7 C216.P$2
  Bottom 0.61: VR202.WIP 162.31,12.95 R213.P$2
N$58
  Bottom 0.254: R216.P$2 157.48,35.52 C218.P$2
N$59
  Bottom 0.254: R215.P$1 157.48,40.68 C217.P$1
N$60  (via drill 0.51)
  Top 0.254: C219.P$1 U201.2 139.7,20.32 140.97,19.05 v147.96,19.05 149.22,17.78 R213.P$1
  Bottom 0.254: R214.P$2 148.59,38.1 147.96,37.47 v147.96,19.05
N$61
  Top 0.254: IC201.6 142.24,39.37 140.97,38.1 140.97,35.56 143.78,32.75 C214.POS
N$62
  Top 0.254: J201.2 C201.P$1
N$63
  Bottom 0.254: C203.P$2 C201.P$2 C204.P$1
N$64
  Top 0.254: C207.POS 130.81,83.82 128.27,86.36 128.27,92.71 C203.P$1
  Bottom 0.254: R201.P$1 129.54,95.25 | 129.54,95.25 J201.3 | C203.P$1 129.54,95.25
N$65
  Top 0.254: R202.P$1 J201.1 C204.P$2 138.43,90.17 C208.POS
N$66
  Bottom 0.254: R204.P$2 139.43,80.28 C208.NEG
N$67
  Top 0.254: J203.1 R201.P$2 R202.P$2
N$68
  Top 0.254: C207.NEG R203.P$2
N$69
  Top 0.254: R208.P$2 R207.P$1 R209.P$1
N$70
  Top 0.254: IC201.8 143.89,46.61 D203.A
  Bottom 0.254: C211.NEG 142.28,48.22 D203.A
N$71
  Top 0.254: VR201.CCW VR201.WIP 139.7,48.26 139.7,45.72 138.43,44.45 IC201.1
  Bottom 0.254: IC201.1 133.35,44.45 D202.A
N$72
  Bottom 0.61: VR203.CW 157.12,30.16 C218.P$1
N$73
  Bottom 0.61: VR203.CCW 157.12,46.05 C217.P$2
N$74
  Top 0.254: R210.P$1 148.59,52.07 146.69,53.98 142.88,53.98 VR201.CW
N$75
  Top 0.254: C211.POS 147.28,55.92 R210.P$2
N$76
  Top 0.254: J202.2 C202.P$1
N$77
  Bottom 0.254: C206.P$1 C202.P$2 C205.P$2
N$78
  Top 0.254: C209.POS 156.21,83.82 157.48,85.09 157.48,92.71 C205.P$1 J202.3
N$79
  Top 0.254: C210.POS 148.59,93.98 C206.P$2 J202.1
N$80
  Bottom 0.254: R206.P$2 149.59,80.28 C210.NEG
N$81
  Bottom 0.254: C209.NEG R205.P$2
N$82
  Top 0.254: 146.05,77.74 134.62,77.74 133.22,76.34 D201.AC2 130.81,69.98 R203.P$1 130.81,44.45 D202.C | 146.05,77.74 R208.P$1 | R205.P$1 158.75,71.12 158.75,76.47 157.48,77.74 146.05,77.74
  Bottom 0.254: D202.C IC201.2
N$83
  Top 0.254: R206.P$1 153.67,69.85 153.03,70.48 151.13,70.48 | 151.13,70.48 145.41,70.48 R204.P$1 | R209.P$2 151.13,70.48 | D203.C 135.89,50.8 140.97,55.88 140.97,66.04 R204.P$1 | D201.AC1 141.1,70.99 R204.P$1
  Bottom 0.254: IC201.3 135.89,39.37 137.16,40.64 137.16,45.72 D203.C
N$84
  Top 0.254: C219.P$2 132.08,13.93 131.81,13.66 C220.POS 134.58,11.43 140.93,17.78 U201.6 147.32,17.78 148.59,16.51 151.13,16.51 152.4,17.78 152.4,19.05 151.13,20.32 R211.P$2
  Bottom 0.254: R215.P$2 152.4,38.1 152.4,34.29 149.86,31.75 R211.P$2
N$85
  Top 0.254: C314.NEG 110.49,31.75 111.76,33.02 R316.P$1 114.3,35.56 115.57,34.29 J304.1 115.57,16.51 114.3,15.24 R312.P$1
N$86
  Bottom 0.254: C315.P$1 118.07,21.63 R311.P$1
  Bottom 0.61: VR302.CCW 119.7,20.64 R311.P$1
N$87
  Top 0.61: VR302.CW 122.45,8.36 118.11,12.7 C316.P$1
  Bottom 0.254: C316.P$1 118.07,13.93 R312.P$2
N$88
  Bottom 0.61: VR303.WIP R314.P$1
N$89
  Bottom 0.254: C316.P$2 114.3,12.7 R313.P$2 114.3,22.86 C315.P$2
  Bottom 0.61: VR302.WIP 124.21,12.95 R313.P$2
N$90
  Bottom 0.254: C318.P$2 116.84,33.02 R316.P$2
N$91
  Bottom 0.254: R315.P$1 119.38,40.68 C317.P$1
N$92  (via drill 0.51)
  Top 0.254: C319.P$1 U301.2 | U301.2 97.79,20.32 | R313.P$1 111.12,17.78 v109.86,19.05 102.87,19.05 101.6,20.32 U301.2
  Bottom 0.254: v109.86,19.05 109.86,37.47 110.49,38.1 R314.P$2
N$93
  Top 0.254: IC301.6 104.14,39.37 102.87,38.1 102.87,35.56 105.68,32.75 C314.POS
N$94
  Top 0.254: J301.2 C301.P$1
N$95
  Bottom 0.254: C303.P$2 C301.P$2 C304.P$1
N$96
  Top 0.254: C307.POS 92.71,83.82 90.17,86.36 90.17,92.71 C303.P$1
  Bottom 0.254: R301.P$1 91.44,95.25 | 91.44,95.25 J301.3 | C303.P$1 91.44,95.25
N$97
  Top 0.254: R302.P$1 J301.1 C304.P$2 100.33,90.17 C308.POS
N$98
  Bottom 0.254: R304.P$2 101.33,80.28 C308.NEG
N$99
  Top 0.254: J303.1 R301.P$2 R302.P$2
N$100
  Top 0.254: C307.NEG R303.P$2
N$101
  Top 0.254: R308.P$2 R307.P$1 R309.P$1
N$102
  Top 0.254: IC301.8 105.79,46.61 D303.A
  Bottom 0.254: C311.NEG 104.18,48.22 D303.A
N$103
  Top 0.254: VR301.CCW VR301.WIP 101.6,48.26 101.6,45.72 100.33,44.45 IC301.1
  Bottom 0.254: IC301.1 95.25,44.45 D302.A
N$104
  Bottom 0.61: VR303.CW 119.02,30.16 C318.P$1
N$105
  Bottom 0.61: VR303.CCW 119.02,46.05 C317.P$2
N$106
  Top 0.254: VR301.CW 104.78,53.98 108.58,53.98 110.49,52.07 R310.P$1
N$107
  Top 0.254: C311.POS 109.18,55.92 R310.P$2
N$108
  Top 0.254: J302.2 C302.P$1
N$109
  Bottom 0.254: C306.P$1 C302.P$2 C305.P$2
N$110
  Top 0.254: C309.POS 118.11,83.82 119.38,85.09 119.38,92.71 C305.P$1 J302.3
N$111
  Top 0.254: C310.POS 110.49,93.98 C306.P$2 J302.1
N$112
  Bottom 0.254: R306.P$2 111.49,80.28 C310.NEG
N$113
  Bottom 0.254: C309.NEG R305.P$2
N$114
  Top 0.254: 107.95,77.74 96.52,77.74 95.12,76.34 D301.AC2 92.71,69.98 R303.P$1 92.71,44.45 D302.C | 107.95,77.74 R308.P$1 | R305.P$1 120.65,71.12 120.65,76.47 119.38,77.74 107.95,77.74
  Bottom 0.254: D302.C IC301.2
N$115
  Top 0.254: R304.P$1 105.41,68.83 | R306.P$1 115.57,69.85 114.94,70.48 113.03,70.48 | 113.03,70.48 107.31,70.48 R304.P$1 | R309.P$2 113.03,70.48 | D303.C 97.79,50.8 102.87,55.88 102.87,66.04 R304.P$1 | D301.AC1 103,70.99 R304.P$1
  Bottom 0.254: IC301.3 97.79,39.37 99.06,40.64 99.06,45.72 D303.C
N$116
  Top 0.254: C319.P$2 93.98,13.93 93.71,13.66 C320.POS 96.48,11.43 102.83,17.78 U301.6 109.22,17.78 110.49,16.51 113.03,16.51 114.3,17.78 114.3,19.05 113.03,20.32 R311.P$2
  Bottom 0.254: R311.P$2 111.76,31.75 114.3,34.29 114.3,38.1 R315.P$2
N$117
  Top 0.254: C414.NEG 72.39,31.75 73.66,33.02 R416.P$1 76.2,35.56 77.47,34.29 J404.1 77.47,16.51 76.2,15.24 R412.P$1
N$118
  Bottom 0.254: C415.P$1 79.97,21.63 R411.P$1
  Bottom 0.61: VR402.CCW 81.61,20.64 R411.P$1
N$119
  Top 0.61: VR402.CW 84.35,8.32 C416.P$1
  Bottom 0.254: C416.P$1 79.97,13.93 R412.P$2
N$120
  Bottom 0.61: VR403.WIP R414.P$1
N$121
  Bottom 0.254: C416.P$2 76.2,12.7 R413.P$2 76.2,22.86 C415.P$2
  Bottom 0.61: VR402.WIP 86.11,12.95 R413.P$2
N$122
  Bottom 0.254: C418.P$2 78.74,33.02 R416.P$2
N$123
  Bottom 0.254: R415.P$1 81.28,40.68 C417.P$1
N$124  (via drill 0.51)
  Top 0.254: C419.P$1 U401.2 62.23,20.32 63.5,19.05 v71.75,19.05 73.03,17.78 R413.P$1
  Bottom 0.254: R414.P$2 72.39,38.1 71.75,37.47 v71.75,19.05
N$125
  Top 0.254: IC401.6 66.04,39.37 64.77,38.1 64.77,35.56 67.58,32.75 C414.POS
N$126
  Top 0.254: J401.2 C401.P$1
N$127
  Bottom 0.254: C404.P$1 C401.P$2 C403.P$2
N$128
  Top 0.254: C407.POS 54.61,83.82 52.07,86.36 52.07,92.71 C403.P$1
  Bottom 0.254: R401.P$1 53.34,95.25 | J401.3 53.34,95.25 | C403.P$1 53.34,95.25
N$129
  Top 0.254: R402.P$1 J401.1 C404.P$2 62.23,90.17 C408.POS
N$130
  Bottom 0.254: R404.P$2 63.23,80.28 C408.NEG
N$131
  Top 0.254: J403.1 R401.P$2 R402.P$2
N$132
  Top 0.254: C407.NEG R403.P$2
N$133
  Top 0.254: R408.P$2 R407.P$1 R409.P$1
N$134
  Top 0.254: IC401.8 67.69,46.61 D403.A
  Bottom 0.254: C411.NEG 66.08,48.22 D403.A
N$135
  Top 0.254: VR401.CCW VR401.WIP 63.5,48.26 63.5,45.72 62.23,44.45 IC401.1
  Bottom 0.254: IC401.1 57.15,44.45 D402.A
N$136
  Bottom 0.61: VR403.CW 80.92,30.16 C418.P$1
N$137
  Bottom 0.61: VR403.CCW 80.92,46.05 C417.P$2
N$138
  Top 0.254: R410.P$1 72.39,52.07 70.48,53.98 66.67,53.98 VR401.CW
N$139
  Top 0.254: C411.POS 71.08,55.92 R410.P$2
N$140
  Top 0.254: J402.2 C402.P$1
N$141
  Bottom 0.254: C406.P$1 C402.P$2 C405.P$2
N$142
  Top 0.254: J402.3 C405.P$1 81.28,92.71 81.28,85.09 80.01,83.82 C409.POS
N$143
  Top 0.254: J402.1 C406.P$2 72.39,93.98 C410.POS
N$144
  Bottom 0.254: R406.P$2 73.39,80.28 C410.NEG
N$145
  Bottom 0.254: C409.NEG R405.P$2
N$146
  Top 0.254: R408.P$1 69.85,77.74 | 69.85,77.74 58.42,77.74 57.02,76.34 D401.AC2 54.61,69.98 R403.P$1 54.61,44.45 D402.C | R405.P$1 82.55,71.12 82.55,76.47 81.28,77.74 69.85,77.74
  Bottom 0.254: D402.C IC401.2
N$147
  Top 0.254: R404.P$1 67.31,68.83 | R406.P$1 77.47,69.85 76.83,70.48 74.93,70.48 | 74.93,70.48 69.22,70.48 R404.P$1 | R409.P$2 74.93,70.48 | R404.P$1 64.77,66.04 64.77,55.88 59.69,50.8 D403.C | D401.AC1 64.9,70.99 R404.P$1
  Bottom 0.254: IC401.3 59.69,39.37 60.96,40.64 60.96,45.72 D403.C
N$148
  Top 0.254: C419.P$2 55.88,13.93 55.61,13.66 C420.POS 58.38,11.43 64.73,17.78 U401.6 71.12,17.78 72.39,16.51 74.93,16.51 76.2,17.78 76.2,19.05 74.93,20.32 R411.P$2
  Bottom 0.254: R411.P$2 73.66,31.75 76.2,34.29 76.2,38.1 R415.P$2
N$149
  Top 0.254: R505.P$2 U501.3
N$150
  Top 0.254: R506.P$2 27.94,20.32 29.21,21.59 U501.2
  Bottom 0.254: R506.P$2 R501.P$1 R502.P$1 R503.P$1 R504.P$1 36.83,10.16 37.37,10.7 43.6,10.7 44.45,11.55 C501.P$1
N$151
  Top 0.254: FB501.P$2 33.44,41.06 33.02,40.64 J501.1 30.61,38.23 C505.P$1
N$152
  Top 0.254: D501.AC1 D501.AC2 | C3.POS R508.P$1 49.53,32.53 47,30 46.94,30.06 FB501.P$1 42.89,31.62 D501.AC1 | C502.NEG 37.96,31.48 D501.AC1
N$153
  Top 0.254: D502.12 U502.18
N$154
  Top 0.254: D502.13 U502.17
N$155
  Top 0.254: D502.14 U502.16
N$156
  Top 0.254: D502.15 U502.15
N$157
  Top 0.254: D502.16 U502.14
N$158
  Top 0.254: D502.17 U502.13
N$159
  Top 0.254: D502.18 U502.12
N$160
  Top 0.254: D502.19 U502.11
N$161
  Top 0.254: R510.P$1 R511.P$2 44.45,87.63 43.18,86.36 U502.7
N$162
  Bottom 0.254: U502.8 45.72,88.9 46.99,87.63 R510.P$2 R509.P$1
N$163
  Top 0.254: U501.6 C501.P$2 R507.P$2
N$164
  Top 0.254: R506.P$1 27.94,28.21 C502.POS 41.64,29.48 44.45,26.67 R507.P$1
N$165
  Top 0.254: U502.6 R511.P$1
N$166
  Bottom 0.61: J701.1 3.81,53.21 3.81,50.8 R702.P$2
N$167
  Bottom 0.61: J701.3 3.81,58.55 3.81,60.96 R701.P$2
N$168
  Top 0.254: D701.A R703.P$2
PREOUT
  Top 0.254: R112.P$1 190.5,15.24 191.77,16.51 J104.1 191.77,34.29 190.5,35.56 R116.P$1 187.96,33.02 186.69,31.75 C114.NEG
VCC  (via drill 0.51)
  Top 0.61: D101.POS 175.26,72.39 177.16,70.48 v177.16,57.78 | v139.06,57.78 139.06,70.48 137.16,72.39 D201.POS | v100.97,57.78 100.97,70.48 99.06,72.39 D301.POS | v62.87,57.78 62.87,70.48 60.96,72.39 D401.POS | v22.86,43.18 v22.86,66.04 | R703.P$1 11.43,60.96 R701.P$1 | v41.91,66.04 41.91,61 C2.P$1
  Bottom 0.61: R701.P$1 12.7,64.77 20.32,64.77 | 20.32,64.77 C701.POS 20.32,67.27 19.01,68.58 D602.10 D602.9 D602.8 D602.7 | 36.83,66.04 v22.86,66.04 21.59,64.77 20.32,64.77 | 137.16,74.93 132.08,74.93 130.81,73.66 105.41,73.66 104.14,74.93 99.06,74.93 D301.POS 99.06,75.18 98.81,74.93 93.98,74.93 92.71,73.66 67.31,73.66 66.04,74.93 60.96,74.93 D401.POS 60.96,75.18 60.71,74.93 55.88,74.93 54.61,73.66 53.34,73.66 45.72,66.04 v41.91,66.04 36.83,66.04 | 178.44,41.91 178.44,50.16 177.16,51.44 v177.16,57.78 | 178.44,41.91 178.44,26.67 | 178.44,26.67 178.44,23.88 U101.7 | C121.P$1 178.44,26.67 | v139.06,57.78 139.06,51.44 140.34,50.16 140.34,41.91 | 137.16,74.93 142.24,74.93 143.51,73.66 168.91,73.66 171.58,76.33 D101.POS | 178.44,41.91 IC101.7 C112.P$1 | 140.34,41.91 140.34,26.67 | 140.34,26.67 140.34,23.88 U201.7 | C221.P$1 140.34,26.67 | 140.34,41.91 IC201.7 C212.P$1 | 102.23,41.91 IC301.7 C312.P$1 | 102.23,41.91 102.23,50.16 100.97,51.44 v100.97,57.78 | 102.23,26.67 102.23,23.88 U301.7 | 102.23,26.67 102.23,41.91 | C321.P$1 102.23,26.67 | 64.14,26.67 64.14,41.91 | 64.14,41.91 64.14,50.16 62.87,51.44 v62.87,57.78 | C412.P$1 IC401.7 64.14,41.91 | U501.7 40.01,21.59 38.73,22.86 38.73,27.94 | 38.73,27.94 38.73,29.84 42.04,33.15 D501.POS 42.04,43.05 40.64,44.45 40.64,57.15 | U601.7 14.61,21.59 13.34,22.86 13.34,27.94 | 13.34,27.94 13.34,29.84 16.64,33.15 D601.POS 16.64,41.77 18.05,43.18 v22.86,43.18 | C421.P$1 64.14,26.67 | C603.P$1 13.34,27.94 | C503.P$1 38.73,27.94 | D602.7 U602.3 | D602.7 D602.6 D602.5 D602.4 D602.3 D602.2 D602.1 | 36.83,66.04 D502.10 D502.9 D502.8 D502.7 | D502.7 D502.6 D502.5 D502.4 D502.3 D502.2 D502.1
  Bottom 0.61: D502.7 U502.3 | 40.64,57.15 40.64,59.73 C2.P$1 | U1.8 40.64,57.15 | D201.POS 137.16,74.93 | U401.7 64.14,23.88 64.14,26.67
VNEG  (via drill 0.51)
  Top 0.61: v175.9,56.52 175.9,67.82 D101.NEG | v137.79,56.52 137.79,67.82 D201.NEG | v99.69,56.52 99.69,67.82 D301.NEG | v61.59,56.52 61.59,67.82 D401.NEG
  Bottom 0.61: R702.P$1 20.32,49.53 | 20.32,49.53 22.86,49.53 | C702.NEG 20.32,49.53 | 99.06,69.85 93.98,69.85 92.71,71.12 67.31,71.12 66.04,69.85 60.96,69.85 | 137.16,69.85 142.24,69.85 143.51,71.12 168.91,71.12 171.58,68.45 D101.NEG | 137.16,69.85 132.08,69.85 130.81,71.12 105.41,71.12 104.14,69.85 99.06,69.85 | v175.9,56.52 175.9,50.16 177.16,48.9 177.16,36.83 | 177.16,36.83 177.16,15.24 | 177.16,15.24 177.16,13.29 C122.P$2 | U101.4 177.16,15.24 | v137.79,56.52 137.79,50.16 139.06,48.9 139.06,36.83 | 177.16,36.83 IC101.4 C113.P$1 | 139.06,36.83 139.06,15.24 | 139.06,15.24 139.06,13.29 C222.P$2 | U201.4 139.06,15.24 | C213.P$1 IC201.4 139.06,36.83 | C322.P$2 99.1,11.47 100.97,13.34 100.97,15.24 | 100.97,15.24 100.97,36.83 | 100.97,36.83 100.97,48.9 99.69,50.16 v99.69,56.52 | 100.97,36.83 IC301.4 C313.P$1 | C422.P$2 61,11.47 62.87,13.34 62.87,15.24 | 62.87,15.24 62.87,36.83 | 62.87,36.83 62.87,48.9 61.59,50.16 v61.59,56.52 | U401.4 62.87,15.24 | U301.4 100.97,15.24 | 62.87,36.83 IC401.4 C413.P$1 | C504.P$2 35.6,16.47 | 22.86,49.53 U1.4 35.56,45.72 | 22.86,49.53 22.86,60.96 26.67,64.77 46.99,64.77 53.34,71.12 54.61,71.12 55.88,69.85 60.96,69.85 | U601.4 10.16,16.51 | 10.16,16.51 10.79,16.51 12.06,17.78 12.06,29.84 8.76,33.15 D601.NEG 9,35.8 9,40 11,42 14,42 20.26,48.26 20.28,48.26 20.32,48.3 20.32,49.53 | C604.P$2 10.2,16.47 10.16,16.51 | C1.P$2 35.56,45.72 | U501.4 35.56,16.51 35.6,16.47 | 35.6,16.47 36.16,16.47 37.47,17.78 37.47,29.84 34.16,33.15 D501.NEG 35.56,36.96 35.56,45.72 | D201.NEG 137.16,69.85 | D301.NEG 99.06,69.85 | D401.NEG 60.96,69.85

## Text on the board
tPlace: M2 | M1 | 3 | 1 | 2 | T | S | R | 3 | 1 | 2 | T | S | R | 3 | 1 | 2 | T | S | R | 3 | 1 | 2 | T | S | R | MIC-IN | LINE-IN | LINE-IN | MIC-IN | LINE-IN | MIC-IN | LINE-IN | MIC-IN | PHANT | 4 | PHANT | 3 | PHANT | 2 | PHANT | 1 | V+ | GND | V- | OUT | OUT | PREOUT | PREOUT | PREOUT | PREOUT | EQOUT | EQOUT | EQOUT | EQOUT | OUT | M1 | M2 | GND | GND | OUT | M1 | M2 | GND | GND | OUT | M1 | M2 | GND | GND | OUT | M1 | M2 | GND | GND
bPlace: M2 | M1 | 4 | 3 | 2 | 1
Measures: 4x 9mm | 16x 8mm